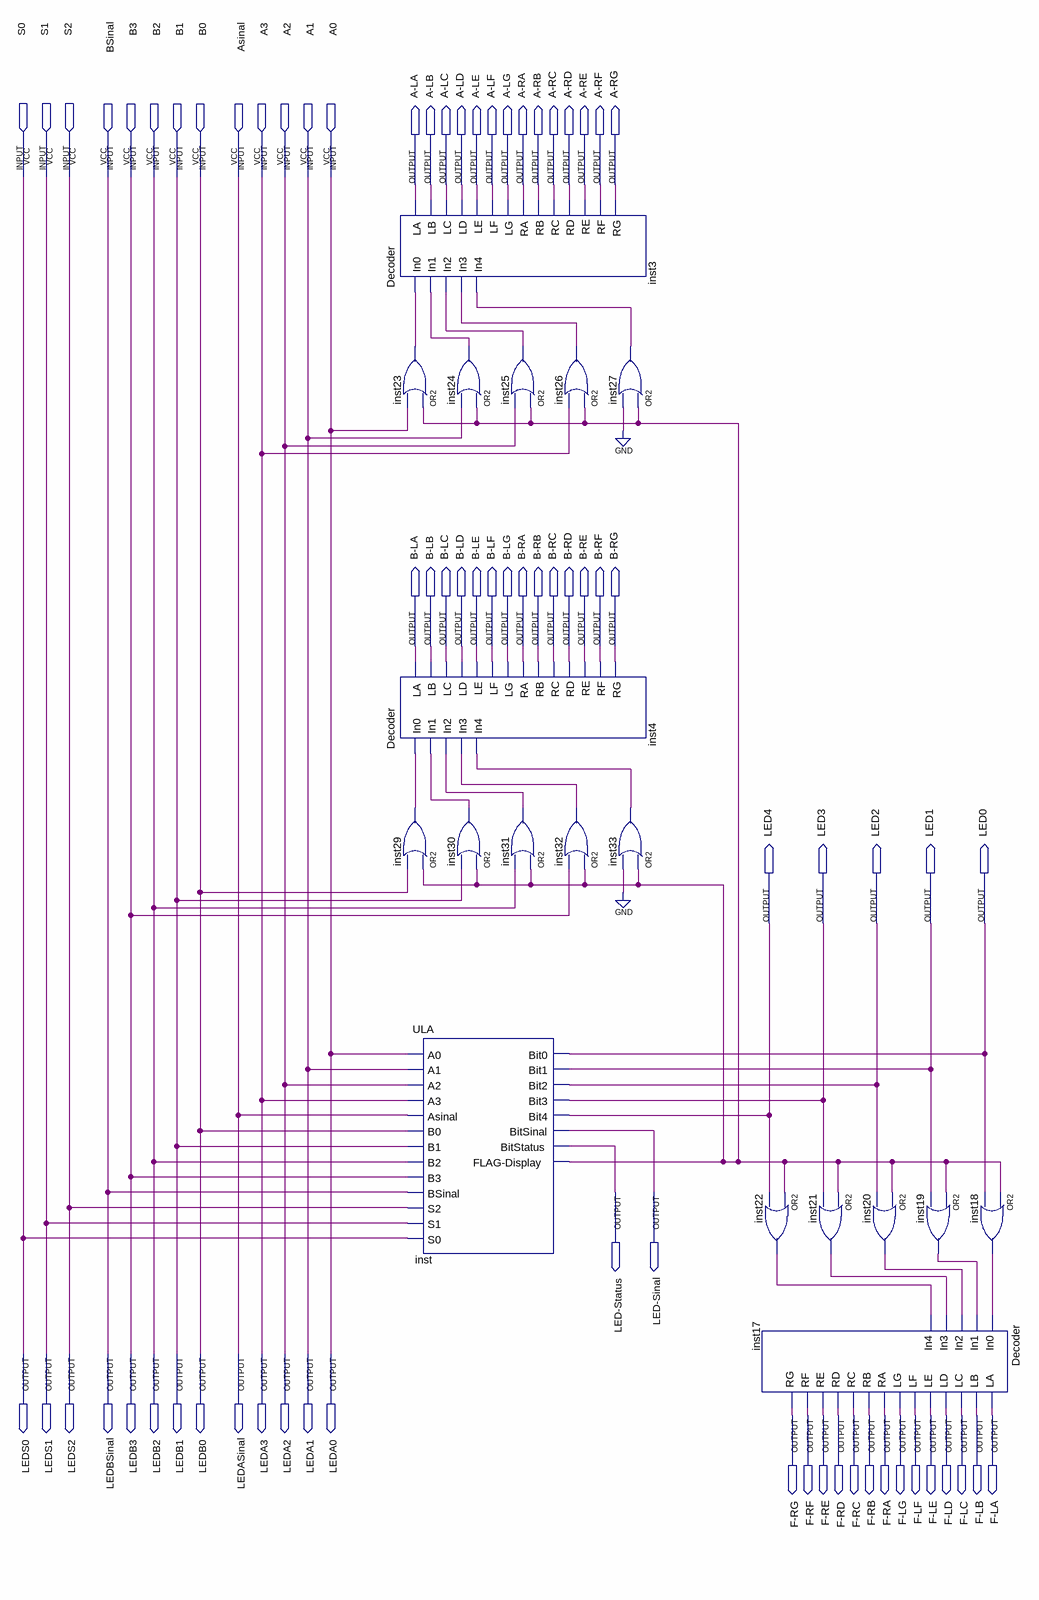
[diagram p0: schematic sheet]
// Quartus schematic Final.bdf as structural Verilog: 19 symbols, 75 pins
module Final (
  input  S0,
  input  S1,
  input  S2,
  input  BSinal,
  input  B3,
  input  B2,
  input  B1,
  input  B0,
  input  Asinal,
  input  A3,
  input  A2,
  input  A1,
  input  A0,
  output \A-LA ,
  output \A-LB ,
  output \A-LC ,
  output \A-LD ,
  output \A-LE ,
  output \A-LF ,
  output \A-LG ,
  output \A-RA ,
  output \A-RB ,
  output \A-RC ,
  output \A-RD ,
  output \A-RE ,
  output \A-RF ,
  output \A-RG ,
  output \B-LA ,
  output \B-LB ,
  output \B-LC ,
  output \B-LD ,
  output \B-LE ,
  output \B-LF ,
  output \B-LG ,
  output \B-RA ,
  output \B-RB ,
  output \B-RC ,
  output \B-RD ,
  output \B-RE ,
  output \B-RF ,
  output \B-RG ,
  output LED4,
  output LED3,
  output LED2,
  output LED1,
  output LED0,
  output \LED-Status ,
  output \LED-Sinal ,
  output LEDS0,
  output LEDS1,
  output LEDS2,
  output LEDBSinal,
  output LEDB3,
  output LEDB2,
  output LEDB1,
  output LEDB0,
  output LEDASinal,
  output LEDA3,
  output LEDA2,
  output LEDA1,
  output LEDA0,
  output \F-RG ,
  output \F-RF ,
  output \F-RE ,
  output \F-RD ,
  output \F-RC ,
  output \F-RB ,
  output \F-RA ,
  output \F-LG ,
  output \F-LF ,
  output \F-LE ,
  output \F-LD ,
  output \F-LC ,
  output \F-LB ,
  output \F-LA 
);

  wire inst18_out, inst19_out, inst20_out, inst21_out, inst22_out, inst23_out, inst24_out, inst25_out,
       inst26_out, inst27_out, inst29_out, inst30_out, inst31_out, inst32_out, inst33_out, inst_flag_display;

  Decoder inst3 (
    .In0(inst23_out), .In1(inst24_out), .In2(inst25_out), .In3(inst26_out), .In4(inst27_out), .LA(\A-LA ),
    .LB(\A-LB ), .LC(\A-LC ), .LD(\A-LD ), .LE(\A-LE ), .LF(\A-LF ), .LG(\A-LG ), .RA(\A-RA ), .RB(\A-RB ),
    .RC(\A-RC ), .RD(\A-RD ), .RE(\A-RE ), .RF(\A-RF ), .RG(\A-RG ));
  or inst23 (inst23_out, inst_flag_display, A0);
  Decoder inst4 (
    .In0(inst29_out), .In1(inst30_out), .In2(inst31_out), .In3(inst32_out), .In4(inst33_out), .LA(\B-LA ),
    .LB(\B-LB ), .LC(\B-LC ), .LD(\B-LD ), .LE(\B-LE ), .LF(\B-LF ), .LG(\B-LG ), .RA(\B-RA ), .RB(\B-RB ),
    .RC(\B-RC ), .RD(\B-RD ), .RE(\B-RE ), .RF(\B-RF ), .RG(\B-RG ));
  or inst29 (inst29_out, inst_flag_display, B0);
  ULA inst (
    .A0(A0), .A1(A1), .A2(A2), .A3(A3), .Asinal(Asinal), .B0(B0), .B1(B1), .B2(B2), .B3(B3), .BSinal(BSinal),
    .S2(S2), .S1(S1), .S0(S0), .Bit0(LED0), .Bit1(LED1), .Bit2(LED2), .Bit3(LED3), .Bit4(LED4),
    .BitSinal(\LED-Sinal ), .BitStatus(\LED-Status ), .\FLAG-Display (inst_flag_display));
  or inst24 (inst24_out, inst_flag_display, A1);
  or inst25 (inst25_out, inst_flag_display, A2);
  or inst30 (inst30_out, inst_flag_display, B1);
  or inst31 (inst31_out, inst_flag_display, B2);
  or inst26 (inst26_out, inst_flag_display, A3);
  or inst32 (inst32_out, inst_flag_display, B3);
  or inst27 (inst27_out, inst_flag_display, 1'b0);
  or inst33 (inst33_out, inst_flag_display, 1'b0);
  Decoder inst17 (
    .In0(inst18_out), .In1(inst19_out), .In2(inst20_out), .In3(inst21_out), .In4(inst22_out), .LA(\F-LA ),
    .LB(\F-LB ), .LC(\F-LC ), .LD(\F-LD ), .LE(\F-LE ), .LF(\F-LF ), .LG(\F-LG ), .RA(\F-RA ), .RB(\F-RB ),
    .RC(\F-RC ), .RD(\F-RD ), .RE(\F-RE ), .RF(\F-RF ), .RG(\F-RG ));
  or inst21 (inst21_out, inst_flag_display, LED3);
  or inst22 (inst22_out, inst_flag_display, LED4);
  or inst20 (inst20_out, inst_flag_display, LED2);
  or inst19 (inst19_out, inst_flag_display, LED1);
  or inst18 (inst18_out, inst_flag_display, LED0);

  assign LEDA0 = A0;
  assign LEDA1 = A1;
  assign LEDA2 = A2;
  assign LEDA3 = A3;
  assign LEDASinal = Asinal;
  assign LEDB0 = B0;
  assign LEDB1 = B1;
  assign LEDB2 = B2;
  assign LEDB3 = B3;
  assign LEDBSinal = BSinal;
  assign LEDS0 = S0;
  assign LEDS1 = S1;
  assign LEDS2 = S2;
endmodule
